# EAGLE design dcmotor (EAGLE 6.3)

## Sheet 1 of 3
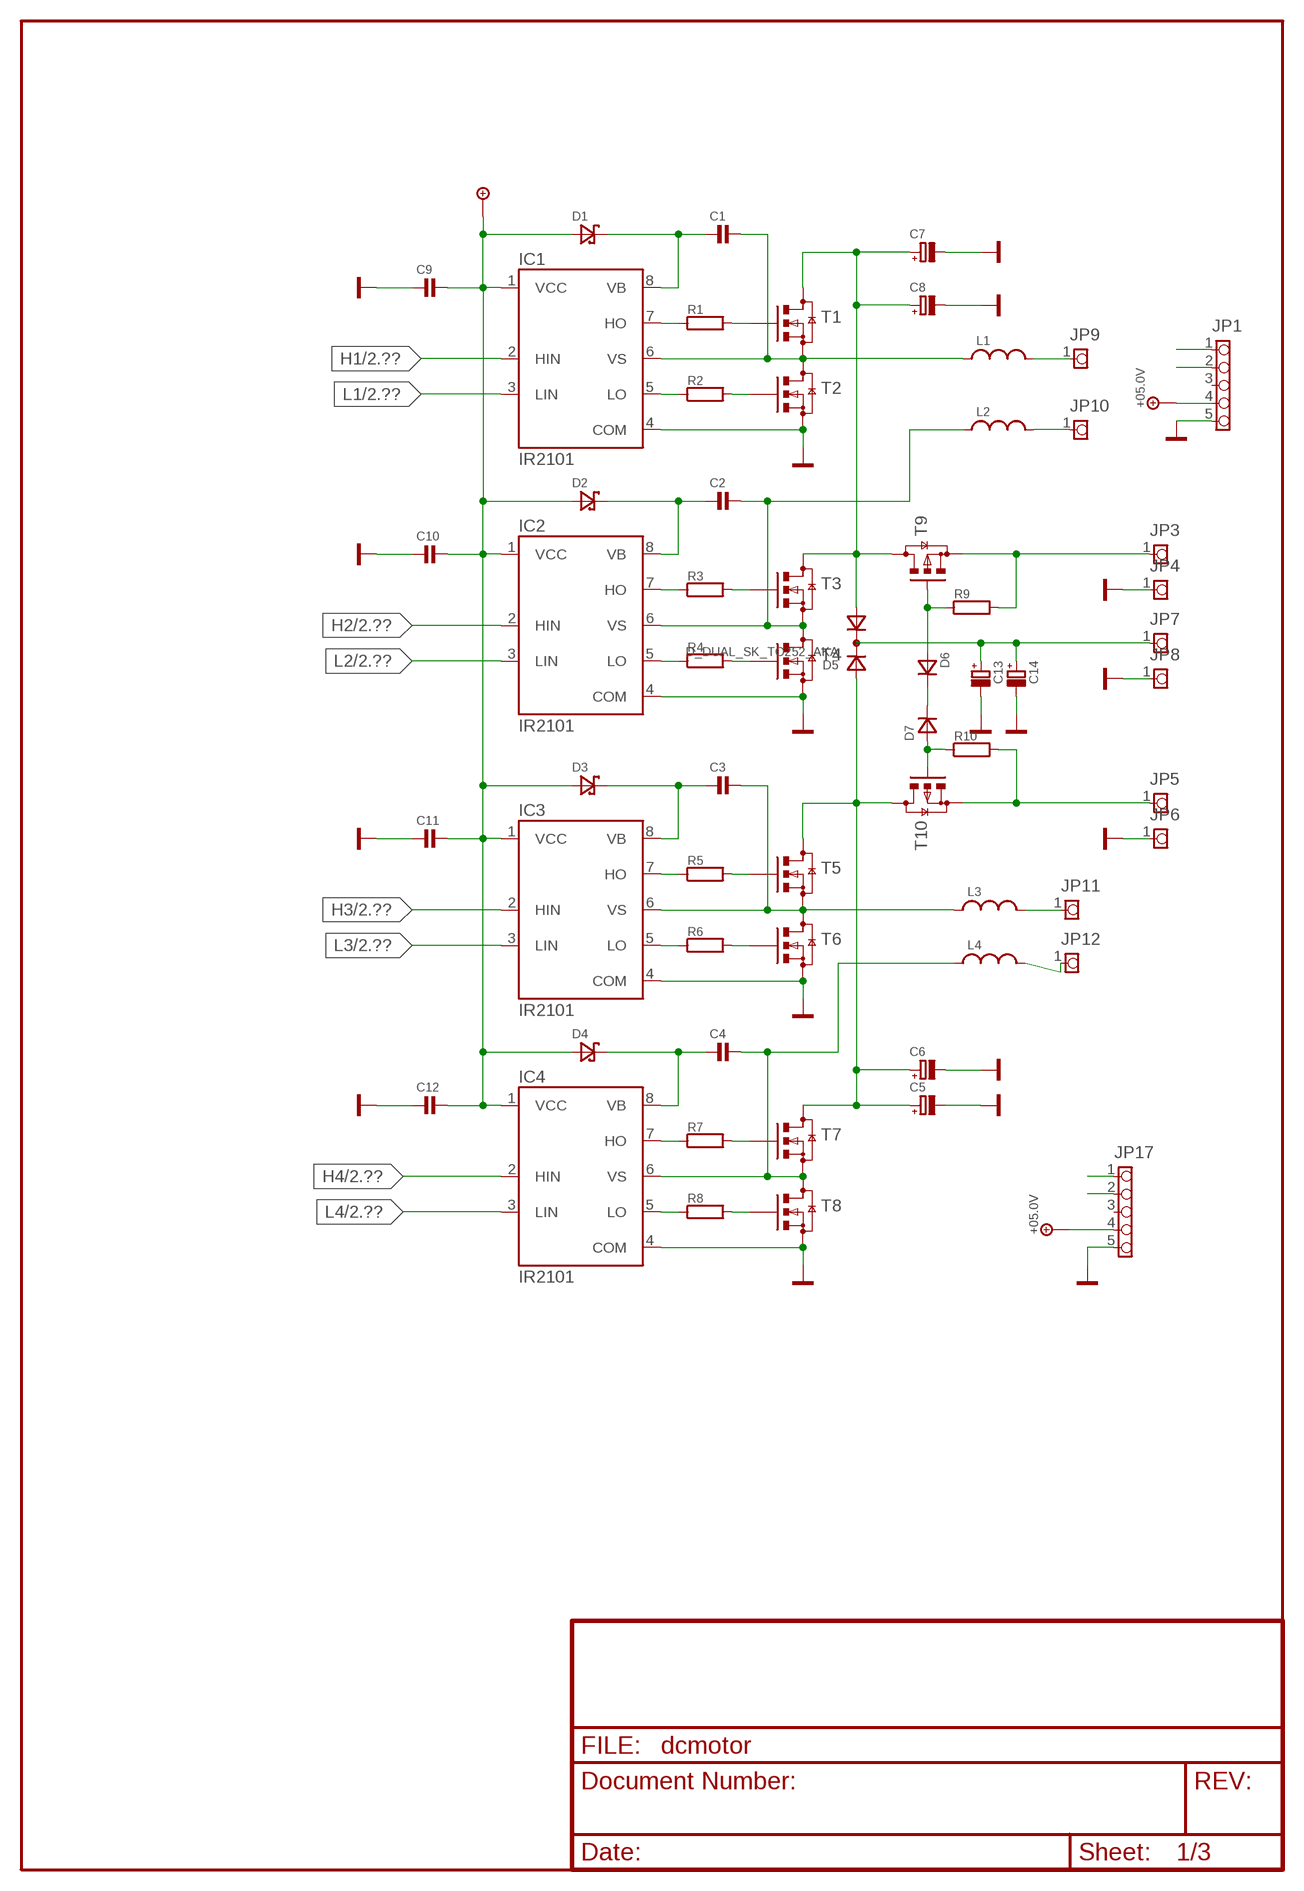
[diagram p0: schematic, sheet 1]

### Parts
C1  C1206  [1206]
C2  C1206  [1206]
C3  C1206  [1206]
C4  C1206  [1206]
C5  CECT7343  [CT7343D]
C6  CECT7343  [CT7343D]
C7  CECT7343  [CT7343D]
C8  CECT7343  [CT7343D]
C9  C1206  [1206]
C10  C1206  [1206]
C11  C1206  [1206]
C12  C1206  [1206]
C13  CECT7343  [CT7343D]
C14  CECT7343  [CT7343D]
D1  D_SCHOTKY_MLL34  [D_MLL34]
D2  D_SCHOTKY_MLL34  [D_MLL34]
D3  D_SCHOTKY_MLL34  [D_MLL34]
D4  D_SCHOTKY_MLL34  [D_MLL34]
D5  D_DUAL_SK_TO252_AKA  [TO252]
D6  D_MLL34  [D_MLL34]
D7  D_MLL34  [D_MLL34]
IC1  IR2101  [SO08]
IC2  IR2101  [SO08]
IC3  IR2101  [SO08]
IC4  IR2101  [SO08]
JP1  PINHD-1X5_250_MX5267  [1X05_250_MX5267]
JP3  PINHD-1X1  [1X01_254]
JP4  PINHD-1X1  [1X01_254]
JP5  PINHD-1X1  [1X01_254]
JP6  PINHD-1X1  [1X01_254]
JP7  PINHD-1X1  [1X01_254]
JP8  PINHD-1X1  [1X01_254]
JP9  PINHD-1X1  [1X01_254]
JP10  PINHD-1X1  [1X01_254]
JP11  PINHD-1X1  [1X01_254]
JP12  PINHD-1X1  [1X01_254]
JP17  PINHD-1X5_250_MX5267  [1X05_250_MX5267]
L1  L_CDRH127  [L_CDRH127]
L2  L_CDRH127  [L_CDRH127]
L3  L_CDRH127  [L_CDRH127]
L4  L_CDRH127  [L_CDRH127]
R1  R_R0603  [0603]
R2  R_R0603  [0603]
R3  R_R0603  [0603]
R4  R_R0603  [0603]
R5  R_R0603  [0603]
R6  R_R0603  [0603]
R7  R_R0603  [0603]
R8  R_R0603  [0603]
R9  R_R0603  [0603]
R10  R_R0603  [0603]
T1  _EMOS_N_TO252_GDS  [TO252]
T2  _EMOS_N_TO252_GDS  [TO252]
T3  _EMOS_N_TO252_GDS  [TO252]
T4  _EMOS_N_TO252_GDS  [TO252]
T5  _EMOS_N_TO252_GDS  [TO252]
T6  _EMOS_N_TO252_GDS  [TO252]
T7  _EMOS_N_TO252_GDS  [TO252]
T8  _EMOS_N_TO252_GDS  [TO252]
T9  _EMOS_P_TO252_GDS  [TO252]
T10  _EMOS_P_TO252_GDS  [TO252]

### Nets
+5.0V: JP1.4 JP17.4 ; supply symbol labelled +05.0V ; also sheet 3
+15V: C9.1 C10.1 C11.1 C12.1 D1.A D2.A D3.A D4.A IC1.1(VCC) IC2.1(VCC) IC3.1(VCC) IC4.1(VCC)
ENC1A: JP1.1 ; also sheet 2
ENC1B: JP1.2 ; also sheet 2
ENC2A: JP17.1 ; also sheet 2
ENC2B: JP17.2 ; also sheet 2
GND: C5.- C6.- C7.- C8.- C9.2 C10.2 C11.2 C12.2 C13.- C14.- IC1.4(COM) IC2.4(COM) IC3.4(COM) IC4.4(COM) JP1.5 JP4.1 JP6.1 JP8.1 JP17.5 T2.3(S) T4.3(S) T6.3(S) T8.3(S) ; also sheet 2,3
H1: IC1.2(HIN) ; also sheet 2
H2: IC2.2(HIN) ; also sheet 2
H3: IC3.2(HIN) ; also sheet 2
H4: IC4.2(HIN) ; also sheet 2
L1: IC1.3(LIN) ; also sheet 2
L2: IC2.3(LIN) ; also sheet 2
L3: IC3.3(LIN) ; also sheet 2
L4: IC4.3(LIN) ; also sheet 2
N$1: C1.1 IC1.6(VS) L1.2 T1.3(S) T2.2(D)
N$2: IC1.7(HO) R1.1
N$3: R1.2 T1.1(G)
N$4: IC1.5(LO) R2.1
N$5: R2.2 T2.1(G)
N$6: C7.+ C8.+ D5.1(A1) T1.2(D) T3.2(D) T9.2(D)
N$7: C5.+ C6.+ D5.3(A2) T5.2(D) T7.2(D) T10.2(D)
N$8: C1.2 D1.K IC1.8(VB)
N$9: C3.1 IC3.6(VS) L3.2 T5.3(S) T6.2(D)
N$10: C2.1 IC2.6(VS) L2.2 T3.3(S) T4.2(D)
N$11: IC2.7(HO) R3.1
N$12: R3.2 T3.1(G)
N$13: IC2.5(LO) R4.1
N$14: R4.2 T4.1(G)
N$15: IC3.7(HO) R5.1
N$16: D6.A R9.1 T9.1(G)
N$17: C2.2 D2.K IC2.8(VB)
N$18: R5.2 T5.1(G)
N$19: IC3.5(LO) R6.1
N$20: R6.2 T6.1(G)
N$21: JP5.1 R10.2 T10.3(S)
N$22: C3.2 D3.K IC3.8(VB)
N$23: C4.1 IC4.6(VS) L4.2 T7.3(S) T8.2(D)
N$24: IC4.7(HO) R7.1
N$25: R7.2 T7.1(G)
N$26: IC4.5(LO) R8.1
N$27: R8.2 T8.1(G)
N$28: C13.+ C14.+ D5.2(K) JP7.1
N$29: C4.2 D4.K IC4.8(VB)
N$30: JP3.1 R9.2 T9.3(S)
N$31: JP11.1 L3.1
N$32: JP12.1 L4.1
N$33: JP9.1 L1.1
N$34: JP10.1 L2.1
N$40: D7.A R10.1 T10.1(G)
N$42: D6.K D7.K
Unconnected: JP1.3 JP17.3

## Sheet 2 of 3
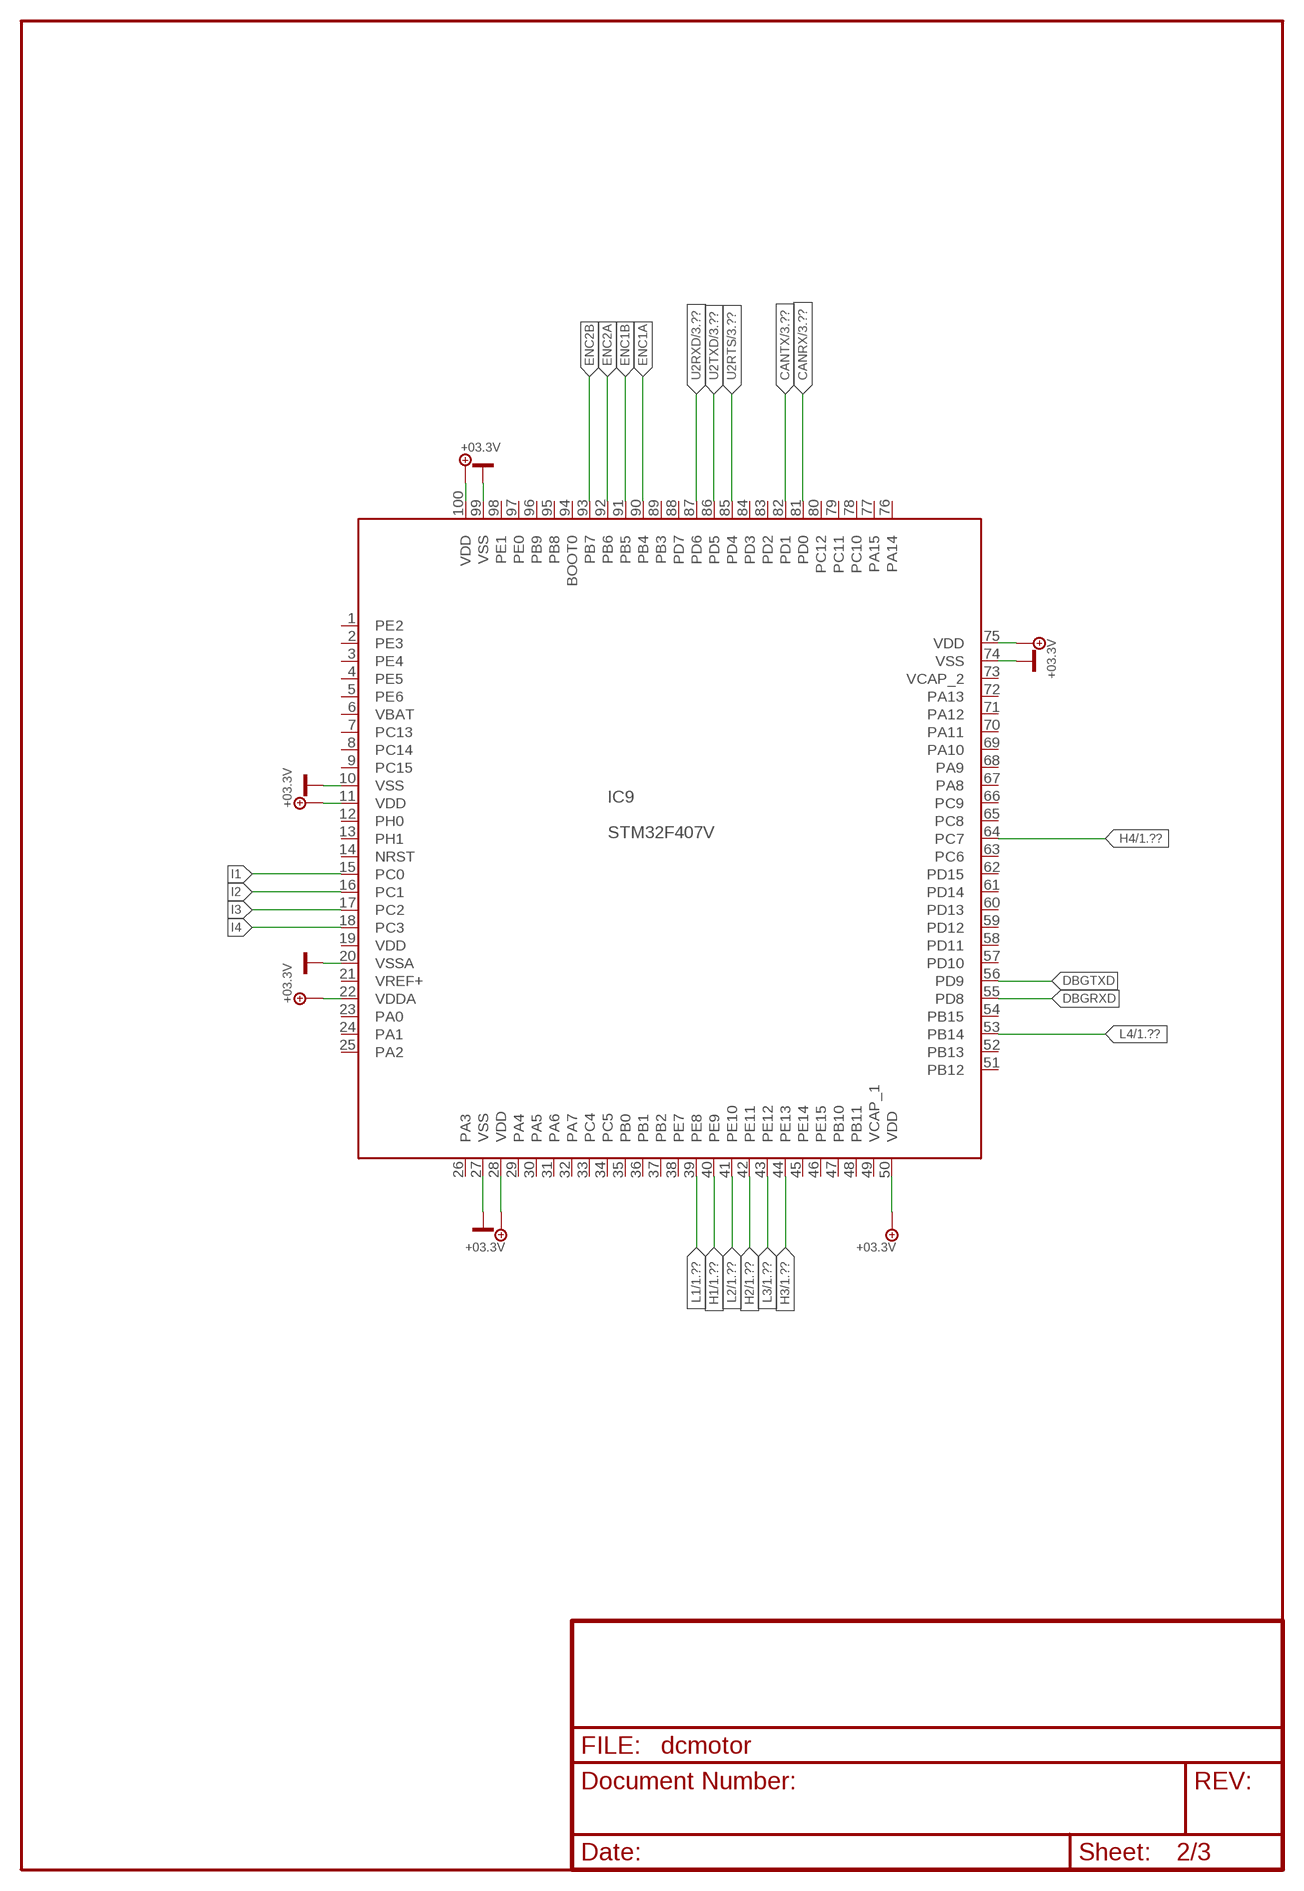
[diagram p1: schematic, sheet 2]

### Parts
IC9  STM32F407V  [LQFP100]

### Nets
+3.3V: IC9.11(VDD) IC9.22(VDDA) IC9.28(VDD) IC9.50(VDD) IC9.75(VDD) IC9.100(VDD) ; supply symbol labelled +03.3V
CANRX: IC9.81(PD0) ; also sheet 3
CANTX: IC9.82(PD1) ; also sheet 3
DBGRXD: IC9.55(PD8)
DBGTXD: IC9.56(PD9)
ENC1A: IC9.90(PB4) ; also sheet 1
ENC1B: IC9.91(PB5) ; also sheet 1
ENC2A: IC9.92(PB6) ; also sheet 1
ENC2B: IC9.93(PB7) ; also sheet 1
GND: IC9.10(VSS) IC9.20(VSSA) IC9.27(VSS) IC9.74(VSS) IC9.99(VSS) ; also sheet 1,3
H1: IC9.40(PE9) ; also sheet 1
H2: IC9.42(PE11) ; also sheet 1
H3: IC9.44(PE13) ; also sheet 1
H4: IC9.64(PC7) ; also sheet 1
I1: IC9.15(PC0)
I2: IC9.16(PC1)
I3: IC9.17(PC2)
I4: IC9.18(PC3)
L1: IC9.39(PE8) ; also sheet 1
L2: IC9.41(PE10) ; also sheet 1
L3: IC9.43(PE12) ; also sheet 1
L4: IC9.53(PB14) ; also sheet 1
U2RTS: IC9.85(PD4) ; also sheet 3
U2RXD: IC9.87(PD6) ; also sheet 3
U2TXD: IC9.86(PD5) ; also sheet 3
Unconnected: IC9.1(PE2) IC9.2(PE3) IC9.3(PE4) IC9.4(PE5) IC9.5(PE6) IC9.6(VBAT) IC9.7(PC13) IC9.8(PC14) IC9.9(PC15) IC9.12(PH0) IC9.13(PH1) IC9.14(NRST) IC9.19(VDD) IC9.21(VREF+) IC9.23(PA0) IC9.24(PA1) IC9.25(PA2) IC9.26(PA3) IC9.29(PA4) IC9.30(PA5) IC9.31(PA6) IC9.32(PA7) IC9.33(PC4) IC9.34(PC5) IC9.35(PB0) IC9.36(PB1) IC9.37(PB2) IC9.38(PE7) IC9.45(PE14) IC9.46(PE15) IC9.47(PB10) IC9.48(PB11) IC9.49(VCAP_1) IC9.51(PB12) IC9.52(PB13) IC9.54(PB15) IC9.57(PD10) IC9.58(PD11) IC9.59(PD12) IC9.60(PD13) IC9.61(PD14) IC9.62(PD15) IC9.63(PC6) IC9.65(PC8) IC9.66(PC9) IC9.67(PA8) IC9.68(PA9) IC9.69(PA10) IC9.70(PA11) IC9.71(PA12) IC9.72(PA13) IC9.73(VCAP_2) IC9.76(PA14) IC9.77(PA15) IC9.78(PC10) IC9.79(PC11) IC9.80(PC12) IC9.83(PD2) IC9.84(PD3) IC9.88(PD7) IC9.89(PB3) IC9.94(BOOT0) IC9.95(PB8) IC9.96(PB9) IC9.97(PE0) IC9.98(PE1)

## Sheet 3 of 3
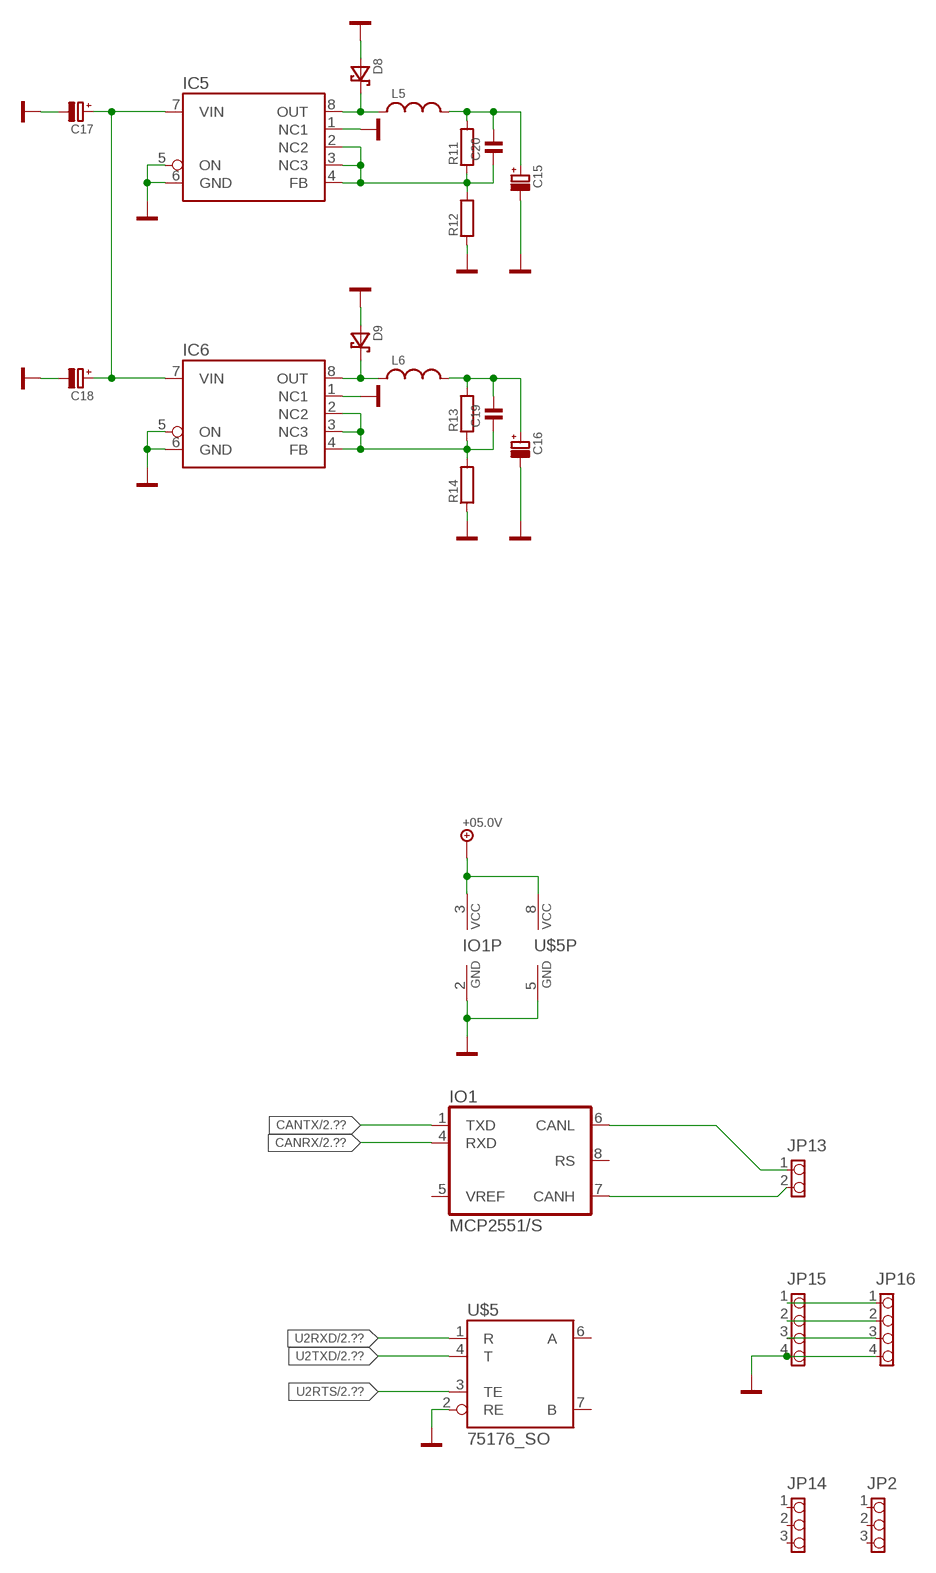
[diagram p2: schematic, sheet 3]

### Parts
C15  CECT7343  [CT7343D]
C16  CECT7343  [CT7343D]
C17  CECT7343  [CT7343D]
C18  CECT7343  [CT7343D]
C19  C0603  [0603]
C20  C0603  [0603]
D8  D_SCHOTKY_SMB  [D_SMB]
D9  D_SCHOTKY_SMB  [D_SMB]
IC5  LM2594_SO  [SO08]
IC6  LM2594_SO  [SO08]
IO1  MCP2551/S  [SO08]
JP2  PINHD-1X3_250_MX5267  [1X03_250_MX5267]
JP13  PINHD-1X2_250_MX5267  [1X02_250_MX5267]
JP14  PINHD-1X3_250_MX5267  [1X03_250_MX5267]
JP15  PINHD-1X4_250_MX5267  [1X04_250_MX5267]
JP16  PINHD-1X4_250_MX5267  [1X04_250_MX5267]
L5  L_SMD_350_200  [L_350_200]
L6  L_SMD_350_200  [L_350_200]
R11  R_R0603  [0603]
R12  R_R0603  [0603]
R13  R_R0603  [0603]
R14  R_R0603  [0603]
U$5  75176_SO  [SO08]

### Nets
+5.0V: IO1.3(VCC) U$5.8(VCC) ; supply symbol labelled +05.0V ; also sheet 1
CANRX: IO1.4(RXD) ; also sheet 2
CANTX: IO1.1(TXD) ; also sheet 2
GND: C15.- C16.- C17.- C18.- D8.A D9.A IC5.1(NC1) IC5.5(ON) IC5.6(GND) IC6.1(NC1) IC6.5(ON) IC6.6(GND) IO1.2(GND) JP15.4 JP16.4 R12.1 R14.1 U$5.2(RE) U$5.5(GND) ; also sheet 1,2
N$35: JP15.1 JP16.1
N$36: JP15.2 JP16.2
N$37: JP15.3 JP16.3
N$38: D8.K IC5.8(OUT) L5.2
N$39: IO1.6(CANL) JP13.1
N$41: IO1.7(CANH) JP13.2
N$43: D9.K IC6.8(OUT) L6.2
N$45: C16.+ C19.1 L6.1 R13.2
N$46: C15.+ C20.1 L5.1 R11.2
N$47: C20.2 IC5.2(NC2) IC5.3(NC3) IC5.4(FB) R11.1 R12.2
N$49: C19.2 IC6.2(NC2) IC6.3(NC3) IC6.4(FB) R13.1 R14.2
N$50: C17.+ C18.+ IC5.7(VIN) IC6.7(VIN)
U2RTS: U$5.3(TE) ; also sheet 2
U2RXD: U$5.1(R) ; also sheet 2
U2TXD: U$5.4(T) ; also sheet 2
Unconnected: IO1.5(VREF) IO1.8(RS) JP2.1 JP2.2 JP2.3 JP14.1 JP14.2 JP14.3 U$5.6(A) U$5.7(B)

## Library data of the parts
C1-C4 C9-C12 C19 C20 = !discrete:C: Kondenzator
C5-C8 C13-C18 = !discrete:CE: Kondenzator Elektrolyt
D1-D4 D8 D9 = !discrete:D_SCHOTKY: Dioda Schottkyho Typ Ur (Urpk] Uf I (Ipk] Pouzdro SD103B 30 V 200 mA DO35 BAT42 30 V 200 mA DO35 BAT43 30 V 200 mA DO35 BAT46 100 V 150 mA DO35 BAT47 20 V 350 mA DO35 BAT48 40 V 350 mA DO35 SK24 40 V (28V) 0.55V 2A (50A) DO214AA (SMB) SK26 60 V 0.65V 2A (50A) DO214AA (SMB)
D5 = !transistor:D_DUAL_SK
D6 D7 = !discrete:D: Dioda Typ U I Pouzdro 1N4148 75 V 150 mA DO35 1N4007 1000 V 1 A DO41
IC1-IC4 = linear:IR2101: IO - Budic pulmustku MOSFET
IC5 IC6 = !stab:LM2594: Stabilizator spinany
IC9 = !ic_stm32:STM32F4*V: IC Mikrokontroler
IO1 = linear:MCP2551: IO - Budic
JP1 JP17 = !pinhead:PINHD-1X5: Konektor Typ Rastr Imax Umax Rmax Kontakt 2.54 mm 500 mA 125 V 50 mOhm krimp /90 2.54 mm 500 mA 125 V 50 mOhm krimp _MX5267 2.50 mm 2.5 A 250 V 20 mOhm krimp _MX53048 1.25 mm 800 mA 125 V 20 mOhm krimp _PV-3.81 3.81 mm 8 A 130 V 30 mOhm ?roub
JP2 JP14 = !pinhead:PINHD-1X3: Konektor 3 PIN Typ Rastr Imax Umax Rmax Kontakt 2.54 mm 500 mA 125 V 50 mOhm krimp /90 2.54 mm 500 mA 125 V 50 mOhm krimp _MX5267 2.50 mm 2.5 A 250 V 20 mOhm krimp _MX53048 1.25 mm 800 mA 125 V 20 mOhm krimp _PV-3.81 3.81 mm 8 A 130 V 30 mOhm ?roub
JP3-JP12 = !pinhead:PINHD-1X1: Konektor 1 PIN Typ Rastr Imax Umax Rmax Kontakt 2.54 mm 500 mA 125 V 50 mOhm krimp /90 2.54 mm 500 mA 125 V 50 mOhm krimp _MX5267 2.50 mm 2.5 A 250 V 20 mOhm krimp _MX53048 1.25 mm 800 mA 125 V 20 mOhm krimp _PV-3.81 3.81 mm 8 A 130 V 30 mOhm ?roub
JP13 = !pinhead:PINHD-1X2: Konektor 2 PIN Typ Rastr Imax Umax Rmax Kontakt 2.54 mm 500 mA 125 V 50 mOhm krimp /90 2.54 mm 500 mA 125 V 50 mOhm krimp _MX5267 2.50 mm 2.5 A 250 V 20 mOhm krimp _MX53048 1.25 mm 800 mA 125 V 20 mOhm krimp _PV-3.81 3.81 mm 8 A 130 V 30 mOhm ?roub
JP15 JP16 = !pinhead:PINHD-1X4: Konektor 4 PIN Typ Rastr Imax Umax Rmax Kontakt 2.54 mm 500 mA 125 V 50 mOhm krimp /90 2.54 mm 500 mA 125 V 50 mOhm krimp _MX5267 2.50 mm 2.5 A 250 V 20 mOhm krimp _MX53048 1.25 mm 800 mA 125 V 20 mOhm krimp _PV-3.81 3.81 mm 8 A 130 V 30 mOhm ?roub
L1-L6 = !discrete:L: Indukcnost
R1-R14 = !discrete:R_: Rezistor
T1-T8 = !transistor:_EMOS_N_: Tranzistor MOSFET - ENHANCED s N kanalem Typ UgsT Uds Id0 Pt rdson Pouzdro BS170 3V 60 V 500 mA 350 mW 1,8 - 5,0 Ohm TO92_GDS IRFZ44N 4V 55 V 49 A 110 W 22 mOhm TO220_GDS IRLR110 2V 100 V 4,3 A 25 W(2.5W) 540 mOhm TO252_GDS IRFP260N 4V 200 V 50 A 300 W 40 mOhm TO247AC_GDS BSS138 1.5V 50 V 220 mA 360 mW 5.8 Ohm SOT23_GDS BSS123 2V 50 V 170 mA 360 mW 10 Ohm SOT23_GDS IRLML6246 [kompl. 2246] 1.1V 30 V 5 A 360 mW 30 mOhm SOT23_GDS
T9 T10 = !transistor:_EMOS_P_: Tranzistor MOSFET - ENHANCED s P kanalem Typ UgsT Uds Id0 Pt rdson Pouzdro IRF9520 -4V -100 V -6 A 40 W 600 mOhm TO220_GDS IRF9540 -4V -55 V -19 A 150 W 200 mOhm TO220_GDS BSS84 -2V -50 V -130 mA 360 mW 10 Ohm SOT23_GDS IRLML2246 [kompl 6246] -1.0V -20 V -2.6 A 1.3 W 135 mOhm SOT23_GDS IRLML6401 -0.55V -12 V -4.3 A 1.3 W 85 mOhm SOT23_GDS
U$5 = linear:75176

## Board
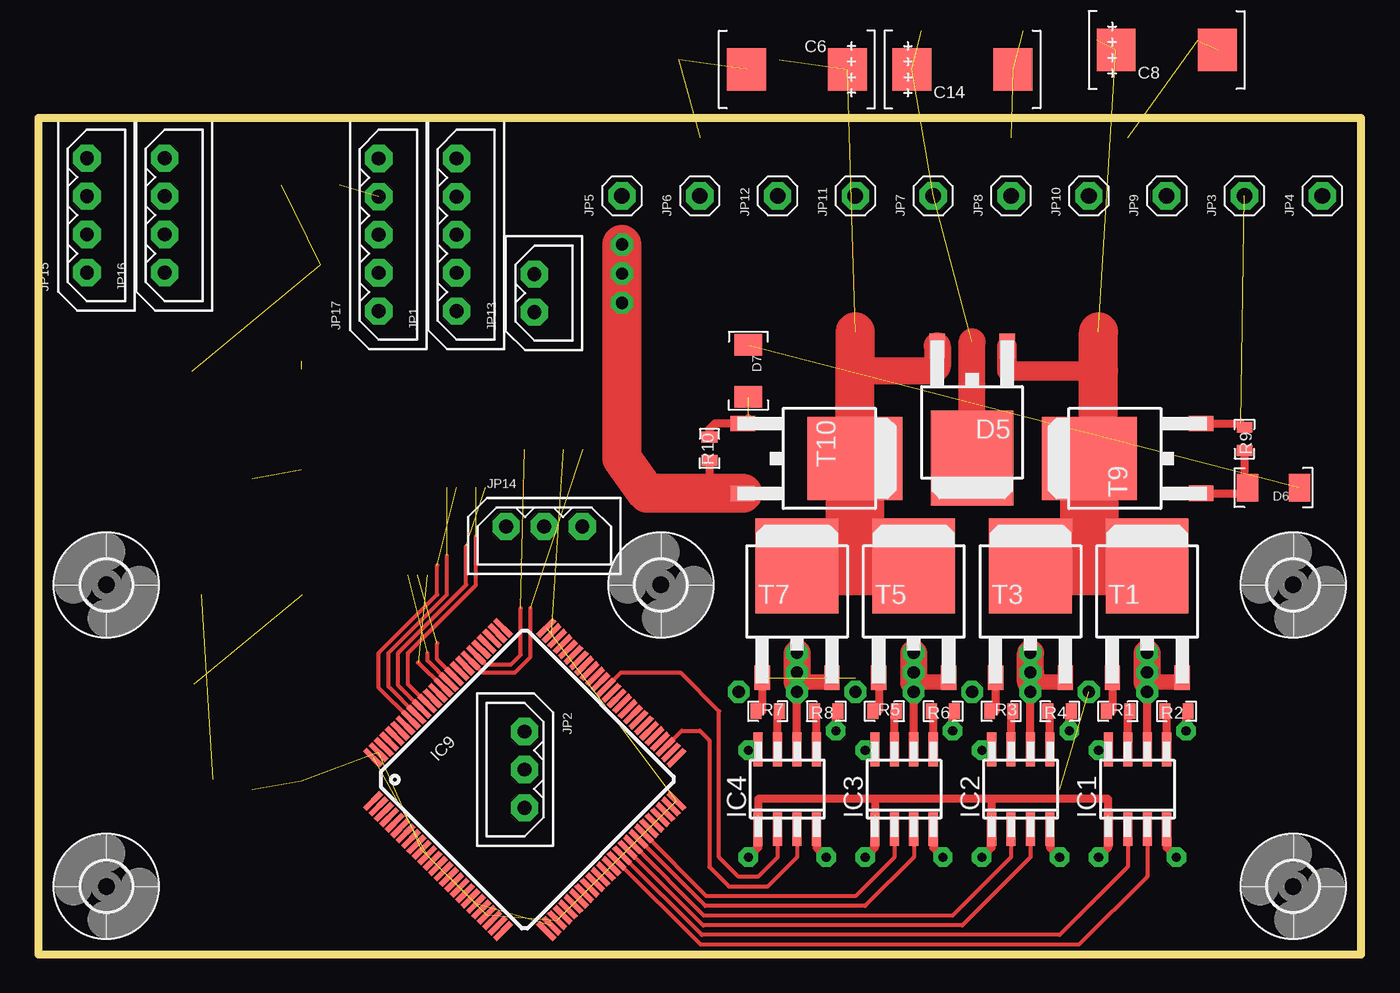
[diagram p3: board, top side]
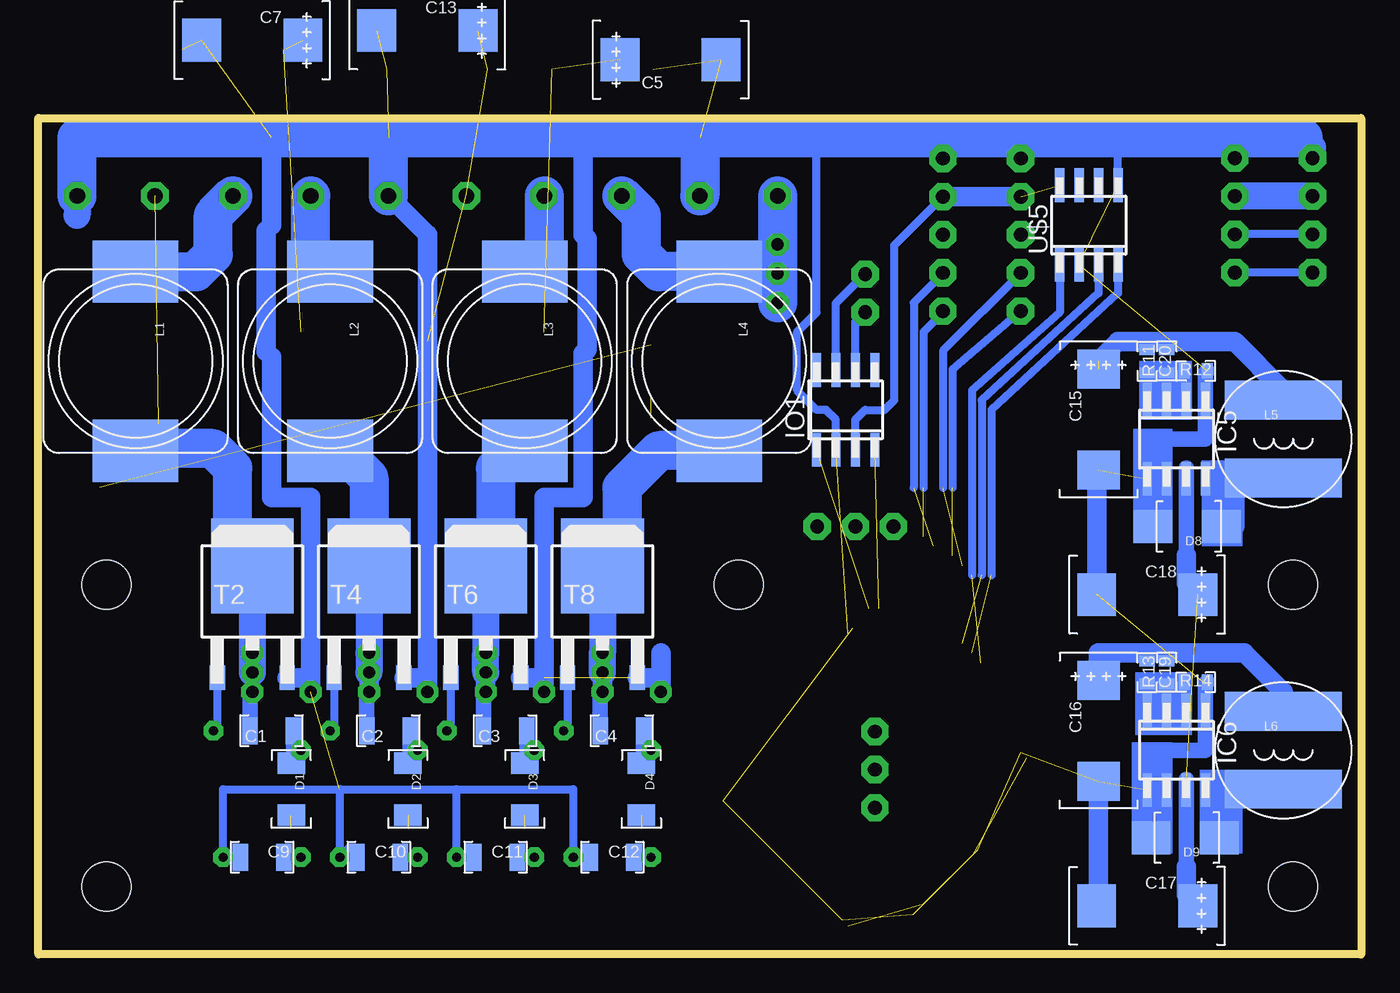
[diagram p4: board, bottom side, seen from below]

Size 86.36 x 54.61 mm. Coordinates in mm from the lower left corner, seen from the top.
Outline: 0,0 86.36,0 86.36,54.61 0,54.61 0,0
Copper layers (1*16): Top 0.035mm / dielectric 1.5mm / Bottom 0.035mm
Design rules "default": minimum track width 10mil, minimum drill 24mil, track to track 8mil, track to pad 8mil, pad to pad 8mil, via to via 8mil, smd to smd 8mil, copper to edge 40mil, drill to drill 8mil, minimum pad ring 10mil, minimum via ring 8mil, stop-mask expansion 4mil, vias tented up to drill 0mil, thermal gap 10mil

### Footprints (pad centres in the part's own frame; a part is rotated, then mirrored left to right if it is on the bottom)
1206 = smd 1.016 x 1.778: 1 -1.422,0; 2 1.422,0
CT7343D = smd 2.54 x 2.794: + -3.302,0; - 3.302,0
0603 = smd 0.711 x 1.016: 1 -0.762,0; 2 0.762,0
D_MLL34 = smd 1.4 x 1.8: A 1.7,0; K -1.7,0
TO252 = smd 1 x 1.6: 1 -2.28,-4.8; 3 2.28,-4.8 | smd 5.4 x 6.2: 2 0,2.5
D_SMB = smd 2.54 x 2.159: A 2.54,0; K -1.905,0
SO08 = smd 0.6 x 2.2: 1 -1.905,-2.6; 2 -0.635,-2.6; 3 0.635,-2.6; 4 1.905,-2.6; 5 1.905,2.6; 6 0.635,2.6; 7 -0.635,2.6; 8 -1.905,2.6
LQFP100 = smd 1.5 x 0.35: 1 -8,6; 2 -8,5.5; 3 -8,5; 4 -8,4.5; 5 -8,4; 6 -8,3.5; 7 -8,3; 8 -8,2.5; 9 -8,2; 10 -8,1.5; 11 -8,1; 12 -8,0.5; 13 -8,0; 14 -8,-0.5; 15 -8,-1; 16 -8,-1.5; 17 -8,-2; 18 -8,-2.5; 19 -8,-3; 20 -8,-3.5; 21 -8,-4; 22 -8,-4.5; 23 -8,-5; 24 -8,-5.5; 25 -8,-6; 51 8,-6; 52 8,-5.5; 53 8,-5; 54 8,-4.5; 55 8,-4; 56 8,-3.5; 57 8,-3; 58 8,-2.5; 59 8,-2; 60 8,-1.5; 61 8,-1; 62 8,-0.5; 63 8,0; 64 8,0.5; 65 8,1; 66 8,1.5; 67 8,2; 68 8,2.5; 69 8,3; 70 8,3.5; 71 8,4; 72 8,4.5; 73 8,5; 74 8,5.5; 75 8,6 | smd 0.35 x 1.5: 26 -6,-8; 27 -5.5,-8; 28 -5,-8; 29 -4.5,-8; 30 -4,-8; 31 -3.5,-8; 32 -3,-8; 33 -2.5,-8; 34 -2,-8; 35 -1.5,-8; 36 -1,-8; 37 -0.5,-8; 38 0,-8; 39 0.5,-8; 40 1,-8; 41 1.5,-8; 42 2,-8; 43 2.5,-8; 44 3,-8; 45 3.5,-8; 46 4,-8; 47 4.5,-8; 48 5,-8; 49 5.5,-8; 50 6,-8; 76 6,8; 77 5.5,8; 78 5,8; 79 4.5,8; 80 4,8; 81 3.5,8; 82 3,8; 83 2.5,8; 84 2,8; 85 1.5,8; 86 1,8; 87 0.5,8; 88 0,8; 89 -0.5,8; 90 -1,8; 91 -1.5,8; 92 -2,8; 93 -2.5,8; 94 -3,8; 95 -3.5,8; 96 -4,8; 97 -4.5,8; 98 -5,8; 99 -5.5,8; 100 -6,8
1X05_250_MX5267 = drill 0.9 pad 1.778 octagon: 1 -4.978,0; 2 -2.489,0; 3 0,0; 4 2.489,0; 5 4.978,0
1X03_250_MX5267 = drill 0.9 pad 1.778 octagon: 1 -2.489,0; 2 0,0; 3 2.489,0
1X01_254 = drill 1.016 pad 1.778 octagon: 1 0,0
1X02_250_MX5267 = drill 0.9 pad 1.778 octagon: 1 -1.245,0; 2 1.245,0
1X04_250_MX5267 = drill 0.9 pad 1.778 octagon: 1 -3.734,0; 2 -1.245,0; 3 1.245,0; 4 3.734,0
L_CDRH127 = smd 4.064 x 5.588: 1 -5.842,0; 2 5.842,0
L_350_200 = smd 2.54 x 7.62: 1 -2.54,0; 2 2.54,0
3,2 = hole 3.2: 0,0

### Placement (x,y rotation side)
C1  71.12,14.61 0 bottom
C2  63.5,14.61 0 bottom
C3  55.88,14.61 0 bottom
C4  48.26,14.61 0 bottom
C5  45.09,58.42 0 bottom  (outside the outline)
C6  49.53,57.78 180 top  (outside the outline)
C7  72.39,59.69 180 bottom  (outside the outline)
C8  73.66,59.05 0 top  (outside the outline)
C9  71.75,6.35 180 bottom
C10  64.14,6.35 180 bottom
C11  56.52,6.35 180 bottom
C12  48.9,6.35 180 bottom
C13  60.96,60.33 180 bottom  (outside the outline)
C14  60.33,57.78 0 top  (outside the outline)
C15  17.14,34.92 270 bottom
C16  17.14,14.61 270 bottom
C17  13.97,3.17 180 bottom
C18  13.97,23.5 180 bottom
C19  12.7,18.41 270 bottom
C20  12.7,38.73 270 bottom
D1  69.85,10.79 270 bottom
D2  62.23,10.79 270 bottom
D3  54.61,10.79 270 bottom
D4  46.99,10.79 270 bottom
D5  60.96,34.92 180 top
D6  80.64,30.48 180 top
D7  46.35,38.1 270 top
D8  11.05,27.94 180 bottom
D9  11.18,7.62 180 bottom
IC1  71.75,10.79 0 top
IC2  64.14,10.79 0 top
IC3  56.52,10.79 0 top
IC4  48.9,10.79 0 top
IC5  12.06,33.66 180 bottom
IC6  12.06,13.34 180 bottom
IC9  31.75,11.43 45 top
IO1  33.66,35.56 0 bottom
JP1  27.3,46.99 90 top
JP2  31.75,12.06 270 top
JP3  78.74,49.53 90 top
JP4  83.82,49.53 90 top
JP5  38.1,49.53 90 top
JP6  43.18,49.53 90 top
JP7  58.42,49.53 90 top
JP8  63.5,49.53 90 top
JP9  73.66,49.53 90 top
JP10  68.58,49.53 90 top
JP11  53.34,49.53 90 top
JP12  48.26,49.53 90 top
JP13  32.38,43.18 90 top
JP14  33.02,27.94 0 top
JP15  3.17,48.26 90 top
JP16  8.26,48.26 90 top
JP17  22.23,46.99 90 top
L1  80.01,38.73 270 bottom
L2  67.31,38.73 270 bottom
L3  54.61,38.73 270 bottom
L4  41.91,38.73 270 bottom
L5  5.08,33.66 270 bottom
L6  5.08,13.34 270 bottom
R1  70.48,15.88 180 top
R2  74.3,15.88 0 top
R3  62.87,15.88 180 top
R4  66.67,15.88 0 top
R5  55.24,15.88 180 top
R6  59.05,15.88 0 top
R7  47.62,15.88 180 top
R8  51.44,15.88 0 top
R9  78.74,33.66 90 top
R10  43.81,33.02 270 top
R11  13.97,38.73 90 bottom
R12  10.79,38.1 180 bottom
R13  13.97,18.41 90 bottom
R14  10.79,17.78 180 bottom
T1  72.39,22.86 0 top
T2  72.39,22.86 0 bottom
T3  64.77,22.86 0 top
T4  64.77,22.86 0 bottom
T5  57.15,22.86 0 top
T6  57.15,22.86 0 bottom
T7  49.53,22.86 0 top
T8  49.53,22.86 0 bottom
T9  71.12,32.38 90 top
T10  50.8,32.38 270 top
U$1  [3,2]  81.92,24.13 90 top
U$2  [3,2]  40.64,24.13 90 top
U$3  [3,2]  4.45,4.45 90 top
U$4  [3,2]  81.92,4.45 90 top
U$5  17.78,47.62 0 bottom
U$6  [3,2]  4.45,24.13 90 top

### Tracks (layer width: path | path; a pad name or v marks a point on that pad's centre or on a via)
+3.3V  (5 unrouted)
+5.0V  (1 unrouted)
  Bottom 0.508: IO1.3 33.02,34.92 32.38,35.56 31.11,35.56 30.48,36.2 30.48,46.3 JP1.4
  Bottom 1.27: JP1.4 JP17.4
+15V  (via drill 0.6 pad 1.27)  (4 unrouted)
  Top 0.508: v61.59,6.35 62.23,6.99 IC2.1 62.23,10.16 | v69.22,6.35 69.85,6.99 IC1.1 69.85,10.16 62.23,10.16 | v53.98,6.35 54.61,6.99 IC3.1 54.61,10.16 | v46.35,6.35 46.99,6.99 IC4.1 46.99,10.16 54.61,10.16 | 62.23,10.16 54.61,10.16
  Bottom 0.508: C12.1 v46.35,6.35 | C11.1 v53.98,6.35 | C10.1 v61.59,6.35 | C9.1 v69.22,6.35
CANRX  (1 unrouted)
  Top 0.254: IC9.81 29.21,18.92 30.86,18.92 31.5,19.56 31.5,22.61
CANTX  (1 unrouted)
  Top 0.254: IC9.82 29.01,18.41 31.11,18.41 32.13,19.43 32.13,22.61
ENC1A  (1 unrouted)
  Top 0.254: IC9.90 24.13,17.64 24.13,19.68 28.57,24.13 28.57,27.3
  Bottom 0.508: JP1.1 27.3,41.91 28.57,40.64 28.57,30.48
ENC1B  (1 unrouted)
  Top 0.254: IC9.91 23.5,17.56 23.5,19.68 27.94,24.13 27.94,26.67
  Bottom 0.508: JP1.2 27.3,44.45 29.21,42.55 29.21,30.48
ENC2A  (1 unrouted)
  Top 0.254: IC9.92 22.86,17.49 22.86,19.68 26.67,23.5 26.67,26.04
  Bottom 0.508: JP17.1 26.67,38.2 26.67,30.48
ENC2B  (1 unrouted)
  Top 0.254: IC9.93 22.23,17.42 22.23,19.68 26.04,23.5 26.04,25.4
  Bottom 0.508: JP17.2 27.3,39.42 27.3,30.48
GND  (via drill 0.6 pad 1.27, 0.8 pad 1.42)  (18 unrouted)
  Top 0.508: IC4.4 50.8,6.99 v51.44,6.35 | IC3.4 58.42,6.99 v59.05,6.35 | IC1.4 73.66,6.99 v74.3,6.35 | IC2.4 66.04,6.99 v66.67,6.35
  Bottom 0.508: 59.05,10.79 v59.05,6.35 C11.2 | 66.04,6.99 v66.67,6.35 | 66.67,10.79 74.3,10.79 v74.3,6.35 C9.2 | 66.67,10.79 v66.67,6.35 | 66.67,10.79 59.05,10.79 | 59.05,10.79 51.44,10.79 v51.44,6.35 C12.2 | C10.2 v66.67,6.35 | IC6.5 13.97,7.87 D9.A | IC6.5 IC6.6 12.7,13.34 | IC6.5 13.97,13.34 | IC5.6 12.7,33.66 13.97,33.66 IC5.5 13.97,28.32 D8.A | IO1.2 34.29,34.92 34.92,35.56 35.56,35.56 36.83,36.83 36.83,40.64 35.56,41.91 35.56,53.34 | U$5.5 15.88,53.34
  Bottom 1.016: 12.7,13.34 10.16,13.34 IC6.1 10.16,17.65 R14.1 | 12.7,33.66 10.16,33.66 IC5.1 10.16,37.97 R12.1
  Bottom 1.27: T2.3 68.58,18.06 | v68.58,17.14 68.58,18.06 | T4.3 60.96,18.06 | 60.96,18.06 v60.96,17.14 | T6.3 53.34,18.06 | 53.34,18.06 v53.34,17.14 | T8.3 45.72,18.06 | 45.72,18.06 v45.72,17.14 | 45.72,18.06 45.72,19.68 | 60.96,18.06 60.96,46.99 JP8.1 | 68.58,18.06 68.58,29.84 71.12,29.84 71.12,38.99 71.5,39.37 71.5,47.24 71.12,47.62 71.12,53.34 | 53.34,18.06 53.34,29.84 50.8,29.84 50.8,39.24 50.55,39.5 50.55,46.74 50.8,46.99 50.8,53.34 | C16.- 17.14,3.3 C17.- | C18.- 17.27,31.5 C15.- | JP17.5 22.23,53.34 | JP1.5 27.3,53.34
  Bottom 1.778: JP4.1 83.82,48.26 | JP15.4 3.17,52.7 3.81,53.34 | JP16.4 8.26,53.34
  Bottom 2.54: JP4.1 83.82,53.34 71.12,53.34 63.5,53.34 | JP8.1 63.5,53.34 | 63.5,53.34 50.8,53.34 43.18,53.34 | 43.18,53.34 JP6.1 | 43.18,53.34 35.56,53.34 27.3,53.34 22.23,53.34 15.88,53.34 8.26,53.34 3.81,53.34
H1
  Top 0.254: IC1.2 71.12,5.71 66.67,1.27 43.32,1.27 IC9.40
H2
  Top 0.254: IC2.2 63.5,6.35 59.69,2.54 43.47,2.54 IC9.42
H3
  Top 0.254: IC3.2 55.88,6.35 53.34,3.81 43.61,3.81 IC9.44
H4
  Top 0.254: IC4.2 48.26,6.35 46.99,5.08 45.72,5.08 44.45,6.35 44.45,15.88 41.91,18.41 38.03,18.41 IC9.64
L1
  Top 0.254: IC1.3 72.39,5.08 67.94,0.64 43.25,0.64 IC9.39
L2
  Top 0.254: IC2.3 64.77,6.35 60.33,1.91 43.4,1.91 IC9.41
L3
  Top 0.254: IC3.3 57.15,6.35 53.98,3.17 43.54,3.17 IC9.43
L4
  Top 0.254: IC4.3 49.53,6.35 47.62,4.45 45.09,4.45 43.81,5.71 43.81,13.97 43.18,14.61 42,14.61 IC9.53
N$1  (via drill 0.8 pad 1.42)
  Top 0.508: IC1.6 v72.39,17.14
  Top 1.016: v72.39,17.14 72.39,17.78 74.67,17.78 T1.3
  Top 1.778: 72.39,17.78 v72.39,18.41 v72.39,19.68
  Bottom 1.016: v72.39,18.41 v72.39,17.14 72.54,17.14 C1.1
  Bottom 1.778: T2.2 v72.39,19.68 v72.39,18.41
  Bottom 2.54: T2.2 73.62,25.36 73.66,25.4 73.66,31.75 74.93,33.02 79.88,33.02 L1.2
N$2
  Top 0.508: IC1.7 71.12,15.88 R1.1
N$3
  Top 0.508: T1.1 70.11,15.88 R1.2
N$4
  Top 0.508: IC1.5 73.66,15.88 R2.1
N$5  (via drill 0.6 pad 1.27)
  Top 0.508: v74.93,14.61 74.93,15.75 R2.2
  Bottom 0.508: T2.1 74.67,14.87 v74.93,14.61
N$6  (2 unrouted)
  Top 1.27: D5.1 63.24,38.1 69.22,38.1
  Top 1.778: 63.24,25.36 T3.2
  Top 2.54: T9.2 68.62,33.66 69.22,33.66 69.22,38.1 69.22,40.64
  Top 3.81: T3.2 68.58,25.36 | 68.58,25.36 T1.2 | T9.2 68.62,25.4 68.58,25.36
N$7  (2 unrouted)
  Top 1.778: 58.68,25.36 T5.2 | D5.3 58.68,38.36 58.42,38.1 53.3,38.1
  Top 2.54: T10.2 53.3,38.1 53.34,38.14 53.34,40.64
  Top 3.81: T7.2 53.34,25.36 | 53.34,25.36 T5.2 | T10.2 53.3,25.4 53.34,25.36
N$8  (via drill 0.6 pad 1.27)
  Top 0.508: IC1.8 69.85,13.34 v69.22,13.34
  Bottom 0.508: v69.22,13.34 69.7,13.34
  Bottom 1.016: C1.2 69.7,13.34 69.7,12.49 D1.K
N$9  (via drill 0.8 pad 1.42)
  Top 0.508: IC3.6 v57.15,17.14
  Top 1.016: T5.3 59.43,17.78 57.15,17.78
  Top 1.27: v57.15,17.14 57.15,17.78
  Top 1.778: 57.15,17.78 v57.15,18.41 v57.15,19.68
  Bottom 1.016: C3.1 57.3,17.14 v57.15,17.14
  Bottom 1.27: v57.15,17.14 v57.15,18.41
  Bottom 1.778: T6.2 v57.15,19.68 v57.15,18.41
  Bottom 2.54: L3.2 55.37,32.89 56.52,31.75 56.52,26 T6.2
N$10  (via drill 0.8 pad 1.42)
  Top 0.508: IC2.6 v64.77,17.14
  Top 1.016: T3.3 67.05,17.78 64.77,17.78
  Top 1.27: v64.77,17.14 64.77,17.78
  Top 1.778: 64.77,17.78 v64.77,18.41 v64.77,19.68
  Bottom 1.016: C2.1 64.92,17.14 v64.77,17.14
  Bottom 1.27: v64.77,18.41 v64.77,17.14
  Bottom 1.778: T4.2 v64.77,19.68 v64.77,18.41
  Bottom 2.54: L2.2 66.55,32.89 64.77,31.11 T4.2
N$11
  Top 0.508: R3.1 63.5,15.88 IC2.7
N$12
  Top 0.508: T3.1 62.49,15.88 R3.2
N$13
  Top 0.508: IC2.5 66.04,15.88 R4.1
N$14  (via drill 0.6 pad 1.27)
  Top 0.508: v67.31,14.61 67.31,15.75 R4.2
  Bottom 0.508: T4.1 67.05,14.87 v67.31,14.61
N$15
  Top 0.508: IC3.7 55.88,15.88 R5.1
N$16
  Top 0.508: T9.1 78.57,30.11 D6.A 78.74,30.68 R9.1
N$17  (via drill 0.6 pad 1.27)
  Top 0.508: IC2.8 62.23,13.34 v61.59,13.34
  Bottom 0.508: v61.59,13.34 62.08,13.34
  Bottom 1.016: C2.2 62.08,13.34 62.08,12.49 D2.K
N$18
  Top 0.508: T5.1 54.87,15.88 R5.2
N$19
  Top 0.508: IC3.5 58.42,15.88 R6.1
N$20  (via drill 0.6 pad 1.27)
  Top 0.508: v59.69,14.61 59.69,15.75 R6.2
  Bottom 0.508: T6.1 59.43,14.87 v59.69,14.61
N$21  (via drill 0.8 pad 1.42)
  Top 0.508: R10.2 43.81,30.11
  Top 2.54: T10.3 43.81,30.11 39.74,30.11 38.1,32.38 v38.1,42.55 v38.1,44.45 v38.1,46.35
  Bottom 2.54: JP5.1 v38.1,46.35 v38.1,42.55
N$22  (via drill 0.6 pad 1.27)
  Top 0.508: IC3.8 54.61,13.34 v53.98,13.34
  Bottom 0.508: v53.98,13.34 54.46,13.34
  Bottom 1.016: C3.2 54.46,13.34 54.46,12.49 D3.K
N$23  (via drill 0.8 pad 1.42)
  Top 0.508: IC4.6 v49.53,17.14
  Top 1.016: T7.3 51.81,17.78 49.53,17.78
  Top 1.27: 49.53,17.78 v49.53,17.14
  Top 1.778: v49.53,19.68 v49.53,18.41 49.53,17.78
  Bottom 1.016: C4.1 49.68,17.14 v49.53,17.14
  Bottom 1.27: v49.53,17.14 v49.53,18.41
  Bottom 1.778: T8.2 v49.53,19.68 v49.53,18.41
  Bottom 2.54: L4.2 45.85,32.89 48.26,30.48 48.26,26.63 T8.2
N$24
  Top 0.508: IC4.7 48.26,15.88 R7.1
N$25
  Top 0.508: T7.1 47.25,15.88 R7.2
N$26
  Top 0.508: IC4.5 50.8,15.88 R8.1
N$27  (via drill 0.6 pad 1.27)
  Top 0.508: v52.07,14.61 52.07,15.75 R8.2
  Bottom 0.508: T8.1 51.81,14.87 v52.07,14.61
N$28  (3 unrouted)
  Top 1.778: D5.2 60.96,40.01
N$29  (via drill 0.6 pad 1.27)
  Top 0.508: IC4.8 46.99,13.34 v46.35,13.34
  Bottom 0.508: v46.35,13.34 46.84,13.34
  Bottom 1.016: C4.2 46.84,13.34 46.84,12.49 D4.K
N$30  (1 unrouted)
  Top 0.508: T9.3 78.49,34.66 R9.2
N$31
  Bottom 2.54: JP11.1 53.34,45.85 L3.1
N$32
  Bottom 2.54: L4.1 45.85,44.58 46.99,45.72 46.99,48.26 JP12.1
N$33
  Bottom 2.54: JP9.1 74.93,48.26 74.93,45.72 76.07,44.58 L1.1
N$34
  Bottom 2.54: L2.1 68.45,44.58 68.58,44.45 JP10.1
N$35
  Bottom 0.508: JP15.1 JP16.1
N$36
  Bottom 0.508: JP15.2 JP16.2
N$37
  Bottom 1.778: JP15.3 JP16.3
N$38
  Bottom 0.508: D8.K 10.16,28.96 IC5.8 10.1,31.11
  Bottom 1.27: D8.K 8.26,27.94 8.26,31.11 L5.2
N$39
  Bottom 0.508: IO1.6 33.02,41.3 JP13.1
N$40  (1 unrouted)
  Top 0.508: R10.1 43.81,34.29 44.19,34.66 T10.1 46.35,35.02
N$41
  Bottom 0.508: IO1.7 34.29,42.52 JP13.2
N$42  (1 unrouted)
N$43
  Bottom 0.508: IC6.8 10.16,8.51 D9.K
  Bottom 1.27: L6.2 7.62,10.79 8.89,9.53 8.89,8 D9.K
N$45
  Bottom 0.508: R13.2 13.97,19.68 | C19.1 12.7,19.68
  Bottom 1.27: C16.+ 17.14,19.68 13.97,19.68 12.7,19.68 7.62,19.68 5.08,17.14 L6.1
N$46  (1 unrouted)
  Bottom 0.508: R11.2 13.97,40.01 | C20.1 12.7,40.01
  Bottom 1.27: 17.14,38.73 15.88,40.01 13.97,40.01 12.7,40.01 8.26,40.01 5.08,36.83 L5.1
N$47
  Bottom 0.508: IC5.4 R11.1 13.97,36.2 12.76,36.2 IC5.3 | C20.2 IC5.3 | IC5.3 IC5.2 11.56,36.38 R12.2
N$49
  Bottom 0.508: R13.1 IC6.4 IC6.3 | IC6.3 C19.2 11.68,17.65 R14.2 | IC6.3 IC6.2
N$50  (1 unrouted)
  Bottom 1.016: 11.43,31.75 IC5.7 11.43,26.04 | 11.43,11.43 IC6.7 11.43,5.71
  Bottom 1.27: 11.43,26.04 11.43,24.26 C18.+ | 11.43,5.71 11.43,3.94 C17.+
U2RTS  (1 unrouted)
  Top 0.254: IC9.85 26.04,19.27 26.04,20.32
  Bottom 0.508: U$5.3 17.14,43.18 24.77,36.2 24.77,24.77
U2RXD  (1 unrouted)
  Top 0.254: IC9.87 24.84,19.05 24.77,19.05
  Bottom 0.508: U$5.1 19.68,41.91 25.4,36.83 25.4,24.77
U2TXD  (1 unrouted)
  Top 0.254: IC9.86 25.4,19.19 25.4,19.68
  Bottom 0.508: U$5.4 15.88,43.18 24.13,35.56 24.13,24.77
(copper drawn outside any net)
  shapes: Bottom area x6